# Altium schematic sheet МПСУ.464414.22-01 Power.SchDoc
size 420 x 297 mm; Address1: Address1; Address2: Address2; Address3: Address3; Address4: Address4; SheetNumber: 3; SheetTotal: 3; DocumentTypeSCH: Э3
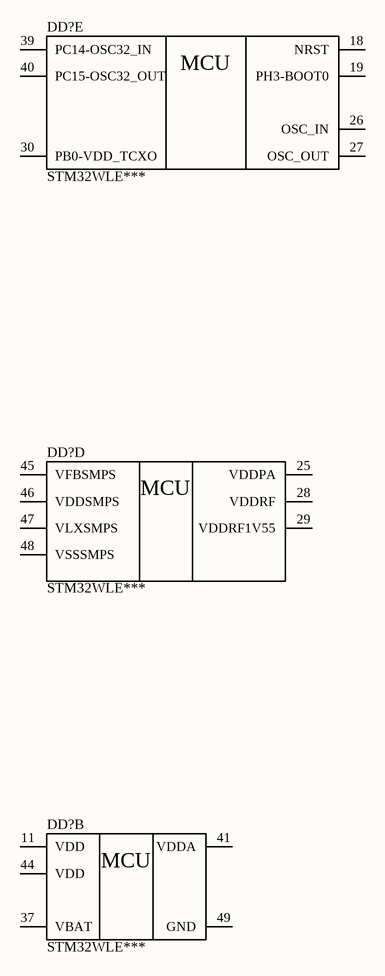
[diagram p0: МПСУ.464414.22-01 Power.SchDoc]

## Parts
(Parts that share a designator on the sheet are numbered #1, #2 ... from top to bottom, then left to right.)
DD?#1  DD?  [QFN50P700X700X90_HS-49N]  (value not drawn)  (part E of 5)
DD?#2  DD?  [QFN50P700X700X90_HS-49N]  (value not drawn)  (part D of 5)
DD?#3  DD?  [QFN50P700X700X90_HS-49N]  (value not drawn)  (part B of 5)

## Nets

Not connected (* = marked no-connect by the designer): DD?#1 18(NRST) 19(PH3-BOOT0) 26(OSC_IN) 27(OSC_OUT) 30(PB0-VDD_TCXO) 39(PC14-OSC32_IN) 40(PC15-OSC32_OUT); DD?#2 25(VDDPA) 28(VDDRF) 29(VDDRF1V55) 45(VFBSMPS) 46(VDDSMPS) 47(VLXSMPS) 48(VSSSMPS); DD?#3 11(VDD) 37(VBAT) 41(VDDA) 44(VDD) 49(GND)

## Notes on the sheet
- Подп. и дата
- Инв. № дубл.
- Взам. инв. №
- Инв. № подл.
- Изм.
- Лист
- № докум.
- Подп.
- Дата
- Копировал
- Формат А3

## Library data of the parts
DD?#1-DD?#3 = STM32WLE***: Multiprotocol LPWAN 32-bit Arm® Cortex®-M4 MCUs, LoRa®, (G)FSK, (G)MSK, BPSK, up to 256KB Flash, 64KB SRAM; Manufacturer: ST Electronics; Designer: Лазба; 3D_Body: +; ComponentLink1Description: Техническое описание; ComponentLink1URL: Q:\Libs\Descriptions_PDF\DS13105.pdf; Category: IC; Subcategory: MCU; Status: Check; PartNumber: STM32WLE***